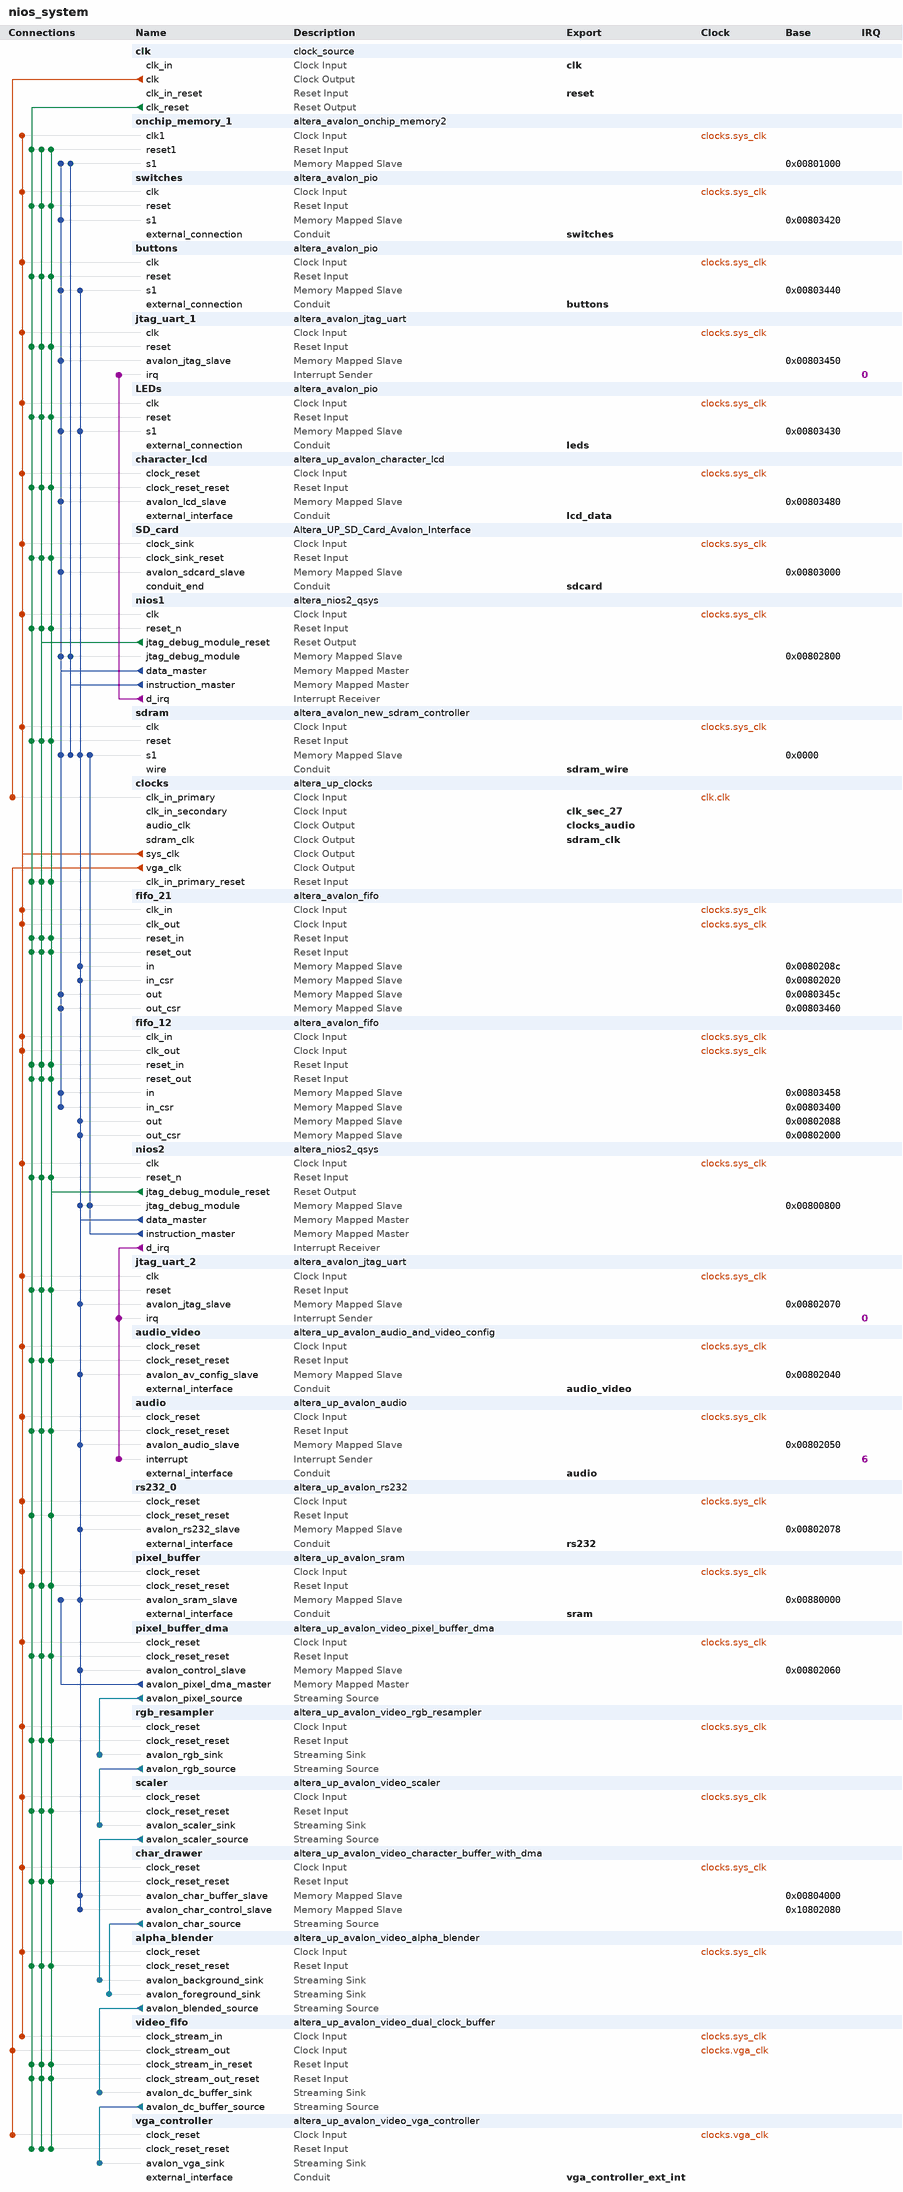
[diagram p0: system contents]
# Platform Designer (Qsys) system nios_system, Cyclone II EP2C35F672C6
# Parameters at their usual value, and those the tool derives, are not listed.
package require -exact qsys 12.0
create_system nios_system
set_project_property DEVICE_FAMILY {Cyclone II}
set_project_property DEVICE EP2C35F672C6

add_instance clk clock_source 12.0
set_instance_parameter_value clk clockFrequency 50000000

add_instance onchip_memory_1 altera_avalon_onchip_memory2 12.0
set_instance_parameter_value onchip_memory_1 dataWidth 32
set_instance_parameter_value onchip_memory_1 dualPort false
set_instance_parameter_value onchip_memory_1 initMemContent true
set_instance_parameter_value onchip_memory_1 initializationFileName onchip_memory_1
set_instance_parameter_value onchip_memory_1 memorySize 4096

add_instance switches altera_avalon_pio 12.0
set_instance_parameter_value switches direction Input
set_instance_parameter_value switches width 18

add_instance buttons altera_avalon_pio 12.0
set_instance_parameter_value buttons bitClearingEdgeCapReg true
set_instance_parameter_value buttons captureEdge true
set_instance_parameter_value buttons direction Input
set_instance_parameter_value buttons irqType EDGE
set_instance_parameter_value buttons width 4

add_instance jtag_uart_1 altera_avalon_jtag_uart 12.0
set_instance_parameter_value jtag_uart_1 simInteractiveOptions INTERACTIVE_ASCII_OUTPUT

add_instance LEDs altera_avalon_pio 12.0
set_instance_parameter_value LEDs direction Output
set_instance_parameter_value LEDs width 18

add_instance character_lcd altera_up_avalon_character_lcd 12.0
set_instance_parameter_value character_lcd cursor Normal

add_instance SD_card Altera_UP_SD_Card_Avalon_Interface 1.0

add_instance nios1 altera_nios2_qsys 12.0
set_instance_parameter_value nios1 cpuReset true
set_instance_parameter_value nios1 cpuID 1
set_instance_parameter_value nios1 resetSlave sdram.s1
set_instance_parameter_value nios1 exceptionSlave sdram.s1
set_instance_parameter_value nios1 breakSlave nios1.jtag_debug_module
set_instance_parameter_value nios1 impl Fast
set_instance_parameter_value nios1 icache_size 4096

add_instance sdram altera_avalon_new_sdram_controller 12.0
set_instance_parameter_value sdram TAC 5.5
set_instance_parameter_value sdram TRCD 20.0
set_instance_parameter_value sdram TRP 20.0
set_instance_parameter_value sdram casLatency 3
set_instance_parameter_value sdram columnWidth 8
set_instance_parameter_value sdram dataWidth 16
set_instance_parameter_value sdram generateSimulationModel false
set_instance_parameter_value sdram model custom
set_instance_parameter_value sdram numberOfBanks 4
set_instance_parameter_value sdram numberOfChipSelects 1
set_instance_parameter_value sdram powerUpDelay 100.0
set_instance_parameter_value sdram refreshPeriod 15.625
set_instance_parameter_value sdram rowWidth 12

add_instance clocks altera_up_clocks 12.0
set_instance_parameter_value clocks board DE2
set_instance_parameter_value clocks vga_clk true
set_instance_parameter_value clocks audio_clk true
set_instance_parameter_value clocks audio_clk_freq 12.288

add_instance fifo_21 altera_avalon_fifo 12.0
set_instance_parameter_value fifo_21 bitsPerSymbol 16
set_instance_parameter_value fifo_21 channelWidth 8
set_instance_parameter_value fifo_21 errorWidth 8
set_instance_parameter_value fifo_21 fifoDepth 16
set_instance_parameter_value fifo_21 fifoInputInterfaceOptions AVALONMM_WRITE
set_instance_parameter_value fifo_21 fifoOutputInterfaceOptions AVALONMM_READ
set_instance_parameter_value fifo_21 singleClockMode false
set_instance_parameter_value fifo_21 symbolsPerBeat 2
set_instance_parameter_value fifo_21 useIRQ true
set_instance_parameter_value fifo_21 usePacket true
set_instance_parameter_value fifo_21 useReadControl true

add_instance fifo_12 altera_avalon_fifo 12.0
set_instance_parameter_value fifo_12 bitsPerSymbol 16
set_instance_parameter_value fifo_12 channelWidth 8
set_instance_parameter_value fifo_12 errorWidth 8
set_instance_parameter_value fifo_12 fifoDepth 512
set_instance_parameter_value fifo_12 fifoInputInterfaceOptions AVALONMM_WRITE
set_instance_parameter_value fifo_12 fifoOutputInterfaceOptions AVALONMM_READ
set_instance_parameter_value fifo_12 singleClockMode false
set_instance_parameter_value fifo_12 symbolsPerBeat 2
set_instance_parameter_value fifo_12 useIRQ true
set_instance_parameter_value fifo_12 usePacket true
set_instance_parameter_value fifo_12 useReadControl true

add_instance nios2 altera_nios2_qsys 12.0
set_instance_parameter_value nios2 resetOffset 7340032
set_instance_parameter_value nios2 exceptionOffset 7340064
set_instance_parameter_value nios2 cpuID 2
set_instance_parameter_value nios2 resetSlave sdram.s1
set_instance_parameter_value nios2 exceptionSlave sdram.s1
set_instance_parameter_value nios2 breakSlave nios2.jtag_debug_module
set_instance_parameter_value nios2 impl Fast
set_instance_parameter_value nios2 icache_size 4096

add_instance jtag_uart_2 altera_avalon_jtag_uart 12.0
set_instance_parameter_value jtag_uart_2 simInteractiveOptions INTERACTIVE_ASCII_OUTPUT

add_instance audio_video altera_up_avalon_audio_and_video_config 12.0
set_instance_parameter_value audio_video board DE2
set_instance_parameter_value audio_video audio_in {Microphone to ADC}
set_instance_parameter_value audio_video line_in_bypass false
set_instance_parameter_value audio_video bit_length 16
set_instance_parameter_value audio_video sampling_rate {32 kHz}

add_instance audio altera_up_avalon_audio 12.0
set_instance_parameter_value audio avalon_bus_type {Memory Mapped}
set_instance_parameter_value audio audio_in true
set_instance_parameter_value audio dw 16

add_instance rs232_0 altera_up_avalon_rs232 12.0
set_instance_parameter_value rs232_0 baud 115200
set_instance_parameter_value rs232_0 parity None

add_instance pixel_buffer altera_up_avalon_sram 12.0
set_instance_parameter_value pixel_buffer board DE2
set_instance_parameter_value pixel_buffer pixel_buffer true

add_instance pixel_buffer_dma altera_up_avalon_video_pixel_buffer_dma 12.0
set_instance_parameter_value pixel_buffer_dma addr_mode X-Y
set_instance_parameter_value pixel_buffer_dma start_address 0
set_instance_parameter_value pixel_buffer_dma back_start_address 0
set_instance_parameter_value pixel_buffer_dma image_width 320
set_instance_parameter_value pixel_buffer_dma image_height 240
set_instance_parameter_value pixel_buffer_dma color_space {16-bit RGB}

add_instance rgb_resampler altera_up_avalon_video_rgb_resampler 12.0
set_instance_parameter_value rgb_resampler input_type {16-bit RGB}
set_instance_parameter_value rgb_resampler output_type {30-bit RGB}
set_instance_parameter_value rgb_resampler alpha 1023

add_instance scaler altera_up_avalon_video_scaler 12.0
set_instance_parameter_value scaler width_scaling 2
set_instance_parameter_value scaler height_scaling 2
set_instance_parameter_value scaler width_in 320
set_instance_parameter_value scaler color_bits 10
set_instance_parameter_value scaler color_planes 3

add_instance char_drawer altera_up_avalon_video_character_buffer_with_dma 12.0
set_instance_parameter_value char_drawer enable_transparency true

add_instance alpha_blender altera_up_avalon_video_alpha_blender 12.0

add_instance video_fifo altera_up_avalon_video_dual_clock_buffer 12.0
set_instance_parameter_value video_fifo color_bits 10

add_instance vga_controller altera_up_avalon_video_vga_controller 12.0
set_instance_parameter_value vga_controller board DE2

# connections
add_connection clk.clk clocks.clk_in_primary clock
add_connection clocks.sys_clk alpha_blender.clock_reset clock
add_connection clocks.sys_clk audio.clock_reset clock
add_connection clocks.sys_clk audio_video.clock_reset clock
add_connection clocks.sys_clk buttons.clk clock
add_connection clocks.sys_clk char_drawer.clock_reset clock
add_connection clocks.sys_clk character_lcd.clock_reset clock
add_connection clocks.sys_clk fifo_12.clk_in clock
add_connection clocks.sys_clk fifo_12.clk_out clock
add_connection clocks.sys_clk fifo_21.clk_in clock
add_connection clocks.sys_clk fifo_21.clk_out clock
add_connection clocks.sys_clk jtag_uart_1.clk clock
add_connection clocks.sys_clk jtag_uart_2.clk clock
add_connection clocks.sys_clk LEDs.clk clock
add_connection clocks.sys_clk nios1.clk clock
add_connection clocks.sys_clk nios2.clk clock
add_connection clocks.sys_clk onchip_memory_1.clk1 clock
add_connection clocks.sys_clk pixel_buffer.clock_reset clock
add_connection clocks.sys_clk pixel_buffer_dma.clock_reset clock
add_connection clocks.sys_clk rgb_resampler.clock_reset clock
add_connection clocks.sys_clk rs232_0.clock_reset clock
add_connection clocks.sys_clk scaler.clock_reset clock
add_connection clocks.sys_clk SD_card.clock_sink clock
add_connection clocks.sys_clk sdram.clk clock
add_connection clocks.sys_clk switches.clk clock
add_connection clocks.sys_clk video_fifo.clock_stream_in clock
add_connection clocks.vga_clk vga_controller.clock_reset clock
add_connection clocks.vga_clk video_fifo.clock_stream_out clock
add_connection clk.clk_reset alpha_blender.clock_reset_reset reset
add_connection clk.clk_reset audio.clock_reset_reset reset
add_connection clk.clk_reset audio_video.clock_reset_reset reset
add_connection clk.clk_reset buttons.reset reset
add_connection clk.clk_reset char_drawer.clock_reset_reset reset
add_connection clk.clk_reset character_lcd.clock_reset_reset reset
add_connection clk.clk_reset clocks.clk_in_primary_reset reset
add_connection clk.clk_reset fifo_12.reset_in reset
add_connection clk.clk_reset fifo_12.reset_out reset
add_connection clk.clk_reset fifo_21.reset_in reset
add_connection clk.clk_reset fifo_21.reset_out reset
add_connection clk.clk_reset jtag_uart_1.reset reset
add_connection clk.clk_reset jtag_uart_2.reset reset
add_connection clk.clk_reset LEDs.reset reset
add_connection clk.clk_reset nios1.reset_n reset
add_connection clk.clk_reset nios2.reset_n reset
add_connection clk.clk_reset onchip_memory_1.reset1 reset
add_connection clk.clk_reset pixel_buffer.clock_reset_reset reset
add_connection clk.clk_reset pixel_buffer_dma.clock_reset_reset reset
add_connection clk.clk_reset rgb_resampler.clock_reset_reset reset
add_connection clk.clk_reset rs232_0.clock_reset_reset reset
add_connection clk.clk_reset scaler.clock_reset_reset reset
add_connection clk.clk_reset SD_card.clock_sink_reset reset
add_connection clk.clk_reset sdram.reset reset
add_connection clk.clk_reset switches.reset reset
add_connection clk.clk_reset vga_controller.clock_reset_reset reset
add_connection clk.clk_reset video_fifo.clock_stream_in_reset reset
add_connection clk.clk_reset video_fifo.clock_stream_out_reset reset
add_connection nios1.jtag_debug_module_reset alpha_blender.clock_reset_reset reset
add_connection nios1.jtag_debug_module_reset audio.clock_reset_reset reset
add_connection nios1.jtag_debug_module_reset audio_video.clock_reset_reset reset
add_connection nios1.jtag_debug_module_reset buttons.reset reset
add_connection nios1.jtag_debug_module_reset char_drawer.clock_reset_reset reset
add_connection nios1.jtag_debug_module_reset character_lcd.clock_reset_reset reset
add_connection nios1.jtag_debug_module_reset clocks.clk_in_primary_reset reset
add_connection nios1.jtag_debug_module_reset fifo_12.reset_in reset
add_connection nios1.jtag_debug_module_reset fifo_12.reset_out reset
add_connection nios1.jtag_debug_module_reset fifo_21.reset_in reset
add_connection nios1.jtag_debug_module_reset fifo_21.reset_out reset
add_connection nios1.jtag_debug_module_reset jtag_uart_1.reset reset
add_connection nios1.jtag_debug_module_reset jtag_uart_2.reset reset
add_connection nios1.jtag_debug_module_reset LEDs.reset reset
add_connection nios1.jtag_debug_module_reset nios1.reset_n reset
add_connection nios1.jtag_debug_module_reset nios2.reset_n reset
add_connection nios1.jtag_debug_module_reset onchip_memory_1.reset1 reset
add_connection nios1.jtag_debug_module_reset pixel_buffer.clock_reset_reset reset
add_connection nios1.jtag_debug_module_reset pixel_buffer_dma.clock_reset_reset reset
add_connection nios1.jtag_debug_module_reset rgb_resampler.clock_reset_reset reset
add_connection nios1.jtag_debug_module_reset scaler.clock_reset_reset reset
add_connection nios1.jtag_debug_module_reset SD_card.clock_sink_reset reset
add_connection nios1.jtag_debug_module_reset sdram.reset reset
add_connection nios1.jtag_debug_module_reset switches.reset reset
add_connection nios1.jtag_debug_module_reset vga_controller.clock_reset_reset reset
add_connection nios1.jtag_debug_module_reset video_fifo.clock_stream_in_reset reset
add_connection nios1.jtag_debug_module_reset video_fifo.clock_stream_out_reset reset
add_connection nios2.jtag_debug_module_reset alpha_blender.clock_reset_reset reset
add_connection nios2.jtag_debug_module_reset audio.clock_reset_reset reset
add_connection nios2.jtag_debug_module_reset audio_video.clock_reset_reset reset
add_connection nios2.jtag_debug_module_reset buttons.reset reset
add_connection nios2.jtag_debug_module_reset char_drawer.clock_reset_reset reset
add_connection nios2.jtag_debug_module_reset character_lcd.clock_reset_reset reset
add_connection nios2.jtag_debug_module_reset clocks.clk_in_primary_reset reset
add_connection nios2.jtag_debug_module_reset fifo_12.reset_in reset
add_connection nios2.jtag_debug_module_reset fifo_12.reset_out reset
add_connection nios2.jtag_debug_module_reset fifo_21.reset_in reset
add_connection nios2.jtag_debug_module_reset fifo_21.reset_out reset
add_connection nios2.jtag_debug_module_reset jtag_uart_1.reset reset
add_connection nios2.jtag_debug_module_reset jtag_uart_2.reset reset
add_connection nios2.jtag_debug_module_reset LEDs.reset reset
add_connection nios2.jtag_debug_module_reset nios1.reset_n reset
add_connection nios2.jtag_debug_module_reset nios2.reset_n reset
add_connection nios2.jtag_debug_module_reset onchip_memory_1.reset1 reset
add_connection nios2.jtag_debug_module_reset pixel_buffer.clock_reset_reset reset
add_connection nios2.jtag_debug_module_reset pixel_buffer_dma.clock_reset_reset reset
add_connection nios2.jtag_debug_module_reset rgb_resampler.clock_reset_reset reset
add_connection nios2.jtag_debug_module_reset rs232_0.clock_reset_reset reset
add_connection nios2.jtag_debug_module_reset scaler.clock_reset_reset reset
add_connection nios2.jtag_debug_module_reset SD_card.clock_sink_reset reset
add_connection nios2.jtag_debug_module_reset sdram.reset reset
add_connection nios2.jtag_debug_module_reset switches.reset reset
add_connection nios2.jtag_debug_module_reset vga_controller.clock_reset_reset reset
add_connection nios2.jtag_debug_module_reset video_fifo.clock_stream_in_reset reset
add_connection nios2.jtag_debug_module_reset video_fifo.clock_stream_out_reset reset
add_connection nios1.data_master buttons.s1 avalon
set_connection_parameter_value nios1.data_master/buttons.s1 baseAddress 0x00803440
add_connection nios1.data_master character_lcd.avalon_lcd_slave avalon
set_connection_parameter_value nios1.data_master/character_lcd.avalon_lcd_slave baseAddress 0x00803480
add_connection nios1.data_master fifo_12.in avalon
set_connection_parameter_value nios1.data_master/fifo_12.in baseAddress 0x00803458
add_connection nios1.data_master fifo_12.in_csr avalon
set_connection_parameter_value nios1.data_master/fifo_12.in_csr baseAddress 0x00803400
add_connection nios1.data_master fifo_21.out avalon
set_connection_parameter_value nios1.data_master/fifo_21.out baseAddress 0x0080345c
add_connection nios1.data_master fifo_21.out_csr avalon
set_connection_parameter_value nios1.data_master/fifo_21.out_csr baseAddress 0x00803460
add_connection nios1.data_master jtag_uart_1.avalon_jtag_slave avalon
set_connection_parameter_value nios1.data_master/jtag_uart_1.avalon_jtag_slave baseAddress 0x00803450
add_connection nios1.data_master LEDs.s1 avalon
set_connection_parameter_value nios1.data_master/LEDs.s1 baseAddress 0x00803430
add_connection nios1.data_master nios1.jtag_debug_module avalon
set_connection_parameter_value nios1.data_master/nios1.jtag_debug_module baseAddress 0x00802800
add_connection nios1.data_master onchip_memory_1.s1 avalon
set_connection_parameter_value nios1.data_master/onchip_memory_1.s1 baseAddress 0x00801000
add_connection nios1.data_master SD_card.avalon_sdcard_slave avalon
set_connection_parameter_value nios1.data_master/SD_card.avalon_sdcard_slave baseAddress 0x00803000
add_connection nios1.data_master sdram.s1 avalon
set_connection_parameter_value nios1.data_master/sdram.s1 baseAddress 0x0000
add_connection nios1.data_master switches.s1 avalon
set_connection_parameter_value nios1.data_master/switches.s1 baseAddress 0x00803420
add_connection nios1.instruction_master nios1.jtag_debug_module avalon
set_connection_parameter_value nios1.instruction_master/nios1.jtag_debug_module baseAddress 0x00802800
add_connection nios1.instruction_master onchip_memory_1.s1 avalon
set_connection_parameter_value nios1.instruction_master/onchip_memory_1.s1 baseAddress 0x00801000
add_connection nios1.instruction_master sdram.s1 avalon
set_connection_parameter_value nios1.instruction_master/sdram.s1 baseAddress 0x0000
add_connection nios2.data_master audio.avalon_audio_slave avalon
set_connection_parameter_value nios2.data_master/audio.avalon_audio_slave baseAddress 0x00802050
add_connection nios2.data_master audio_video.avalon_av_config_slave avalon
set_connection_parameter_value nios2.data_master/audio_video.avalon_av_config_slave baseAddress 0x00802040
add_connection nios2.data_master buttons.s1 avalon
set_connection_parameter_value nios2.data_master/buttons.s1 baseAddress 0x00803440
add_connection nios2.data_master char_drawer.avalon_char_buffer_slave avalon
set_connection_parameter_value nios2.data_master/char_drawer.avalon_char_buffer_slave baseAddress 0x00804000
add_connection nios2.data_master char_drawer.avalon_char_control_slave avalon
set_connection_parameter_value nios2.data_master/char_drawer.avalon_char_control_slave baseAddress 0x10802080
add_connection nios2.data_master fifo_12.out avalon
set_connection_parameter_value nios2.data_master/fifo_12.out baseAddress 0x00802088
add_connection nios2.data_master fifo_12.out_csr avalon
set_connection_parameter_value nios2.data_master/fifo_12.out_csr baseAddress 0x00802000
add_connection nios2.data_master fifo_21.in avalon
set_connection_parameter_value nios2.data_master/fifo_21.in baseAddress 0x0080208c
add_connection nios2.data_master fifo_21.in_csr avalon
set_connection_parameter_value nios2.data_master/fifo_21.in_csr baseAddress 0x00802020
add_connection nios2.data_master jtag_uart_2.avalon_jtag_slave avalon
set_connection_parameter_value nios2.data_master/jtag_uart_2.avalon_jtag_slave baseAddress 0x00802070
add_connection nios2.data_master LEDs.s1 avalon
set_connection_parameter_value nios2.data_master/LEDs.s1 baseAddress 0x00803430
add_connection nios2.data_master nios2.jtag_debug_module avalon
set_connection_parameter_value nios2.data_master/nios2.jtag_debug_module baseAddress 0x00800800
add_connection nios2.data_master pixel_buffer.avalon_sram_slave avalon
set_connection_parameter_value nios2.data_master/pixel_buffer.avalon_sram_slave baseAddress 0x00880000
add_connection nios2.data_master pixel_buffer_dma.avalon_control_slave avalon
set_connection_parameter_value nios2.data_master/pixel_buffer_dma.avalon_control_slave baseAddress 0x00802060
add_connection nios2.data_master rs232_0.avalon_rs232_slave avalon
set_connection_parameter_value nios2.data_master/rs232_0.avalon_rs232_slave baseAddress 0x00802078
add_connection nios2.data_master sdram.s1 avalon
set_connection_parameter_value nios2.data_master/sdram.s1 baseAddress 0x0000
add_connection nios2.instruction_master nios2.jtag_debug_module avalon
set_connection_parameter_value nios2.instruction_master/nios2.jtag_debug_module baseAddress 0x00800800
add_connection nios2.instruction_master sdram.s1 avalon
set_connection_parameter_value nios2.instruction_master/sdram.s1 baseAddress 0x0000
add_connection pixel_buffer_dma.avalon_pixel_dma_master pixel_buffer.avalon_sram_slave avalon
set_connection_parameter_value pixel_buffer_dma.avalon_pixel_dma_master/pixel_buffer.avalon_sram_slave baseAddress 0x00880000
add_connection alpha_blender.avalon_blended_source video_fifo.avalon_dc_buffer_sink avalon_streaming
add_connection char_drawer.avalon_char_source alpha_blender.avalon_foreground_sink avalon_streaming
add_connection pixel_buffer_dma.avalon_pixel_source rgb_resampler.avalon_rgb_sink avalon_streaming
add_connection rgb_resampler.avalon_rgb_source scaler.avalon_scaler_sink avalon_streaming
add_connection scaler.avalon_scaler_source alpha_blender.avalon_background_sink avalon_streaming
add_connection video_fifo.avalon_dc_buffer_source vga_controller.avalon_vga_sink avalon_streaming
add_connection nios1.d_irq jtag_uart_1.irq interrupt
set_connection_parameter_value nios1.d_irq/jtag_uart_1.irq irqNumber 0
add_connection nios2.d_irq audio.interrupt interrupt
set_connection_parameter_value nios2.d_irq/audio.interrupt irqNumber 6
add_connection nios2.d_irq jtag_uart_2.irq interrupt
set_connection_parameter_value nios2.d_irq/jtag_uart_2.irq irqNumber 0

# exported interfaces
add_interface clk clock sink
set_interface_property clk EXPORT_OF clk.clk_in
add_interface reset reset sink
set_interface_property reset EXPORT_OF clk.clk_in_reset
add_interface leds conduit end
set_interface_property leds EXPORT_OF LEDs.external_connection
add_interface sdram_wire conduit end
set_interface_property sdram_wire EXPORT_OF sdram.wire
add_interface sdram_clk clock source
set_interface_property sdram_clk EXPORT_OF clocks.sdram_clk
add_interface lcd_data conduit end
set_interface_property lcd_data EXPORT_OF character_lcd.external_interface
add_interface audio_video conduit end
set_interface_property audio_video EXPORT_OF audio_video.external_interface
add_interface audio conduit end
set_interface_property audio EXPORT_OF audio.external_interface
add_interface sdcard conduit end
set_interface_property sdcard EXPORT_OF SD_card.conduit_end
add_interface clk_sec_27 clock sink
set_interface_property clk_sec_27 EXPORT_OF clocks.clk_in_secondary
add_interface clocks_audio clock source
set_interface_property clocks_audio EXPORT_OF clocks.audio_clk
add_interface buttons conduit end
set_interface_property buttons EXPORT_OF buttons.external_connection
add_interface switches conduit end
set_interface_property switches EXPORT_OF switches.external_connection
add_interface rs232 conduit end
set_interface_property rs232 EXPORT_OF rs232_0.external_interface
add_interface sram conduit end
set_interface_property sram EXPORT_OF pixel_buffer.external_interface
add_interface vga_controller_ext_int conduit end
set_interface_property vga_controller_ext_int EXPORT_OF vga_controller.external_interface

save_system nios_system.qsys
